# Altium schematic sheet LED_Driver_NF2W757GT-F1.SchDoc: STB Light Board - 5000K
size A3; Author: mayerph; DrawnBy: mayerph; Organization: PBL; Revision: A; SheetNumber: 7; SheetTotal: 20
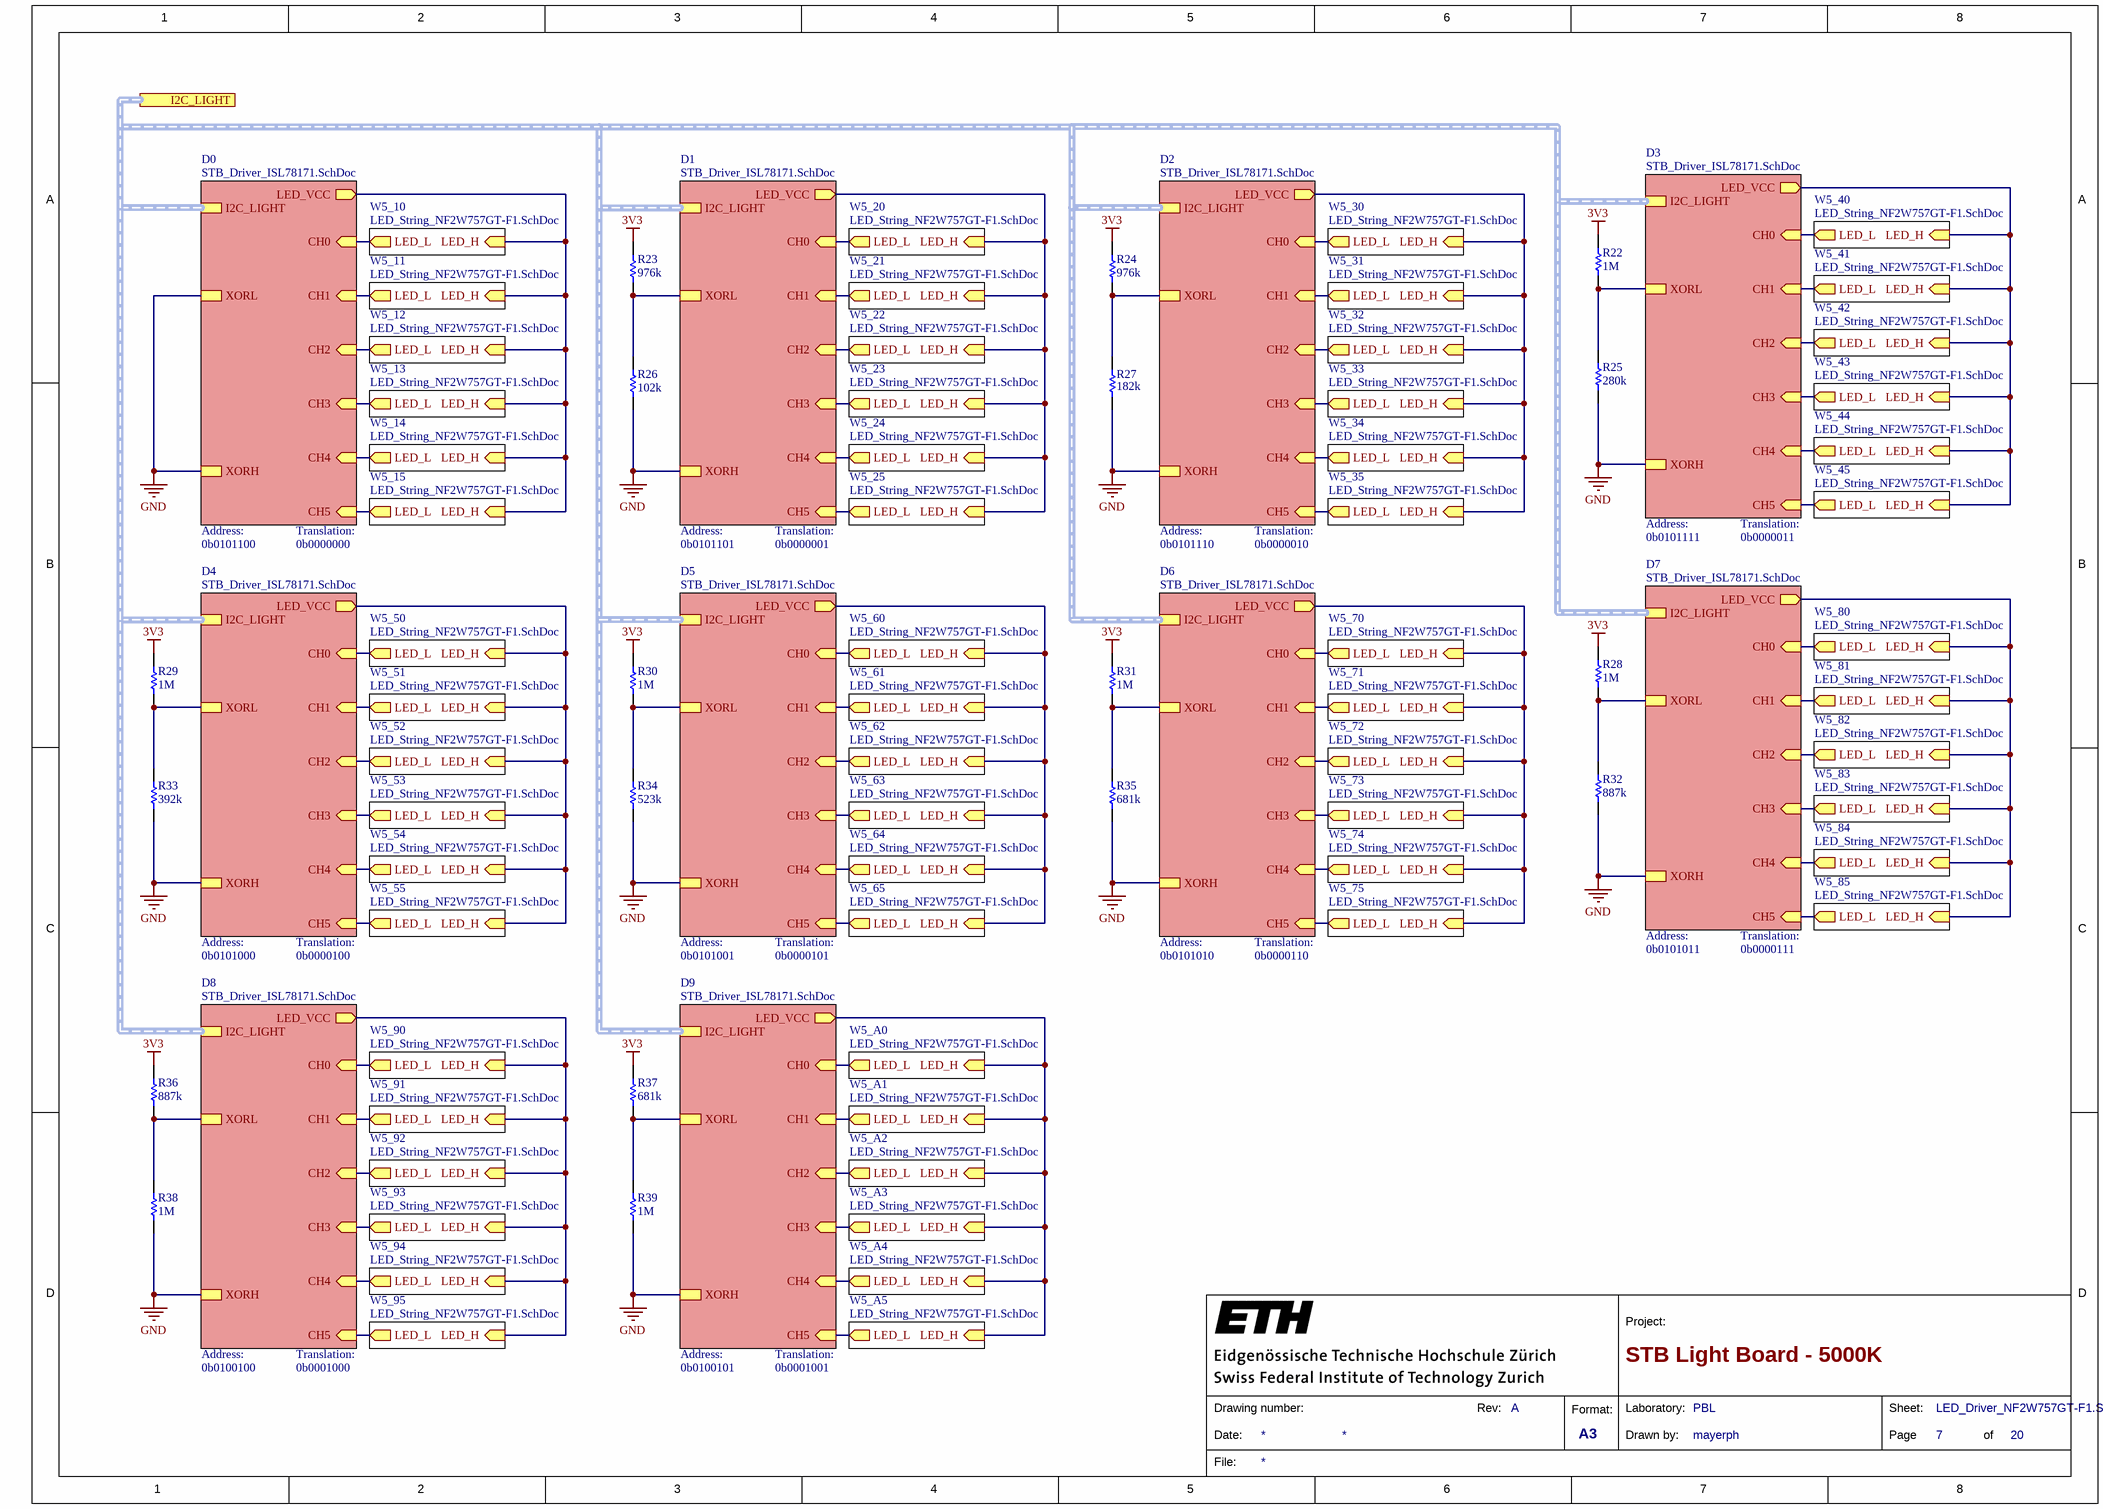
[diagram p0: LED_Driver_NF2W757GT-F1.SchDoc]

## Parts
R22  1M  [RESC1005X40X25LL05T05]
R23  976k  [RESC1005X40X25LL05T05]
R24  976k  [RESC1005X40X25LL05T05]
R25  280k  [RESC1005X40X25LL05T05]
R26  102k  [RESC1005X40X25LL05T05]
R27  182k  [RESC1005X40X25LL05T05]
R28  1M  [RESC1005X40X25LL05T05]
R29  1M  [RESC1005X40X25LL05T05]
R30  1M  [RESC1005X40X25LL05T05]
R31  1M  [RESC1005X40X25LL05T05]
R32  887k  [RESC1005X40X25LL05T10]
R33  392k  [RESC1005X40X25LL05T05]
R34  523k  [RESC1005X40X25LL05T05]
R35  681k  [RESC1005X40X25LL05T05]
R36  887k  [RESC1005X40X25LL05T10]
R37  681k  [RESC1005X40X25LL05T05]
R38  1M  [RESC1005X40X25LL05T05]
R39  1M  [RESC1005X40X25LL05T05]

## Sub-sheets
D0 = STB_Driver_ISL78171.SchDoc: CH0 (in), XORL, XORH, LED_VCC (out), CH1 (in), CH2 (in), CH3 (in), CH4 (in), CH5 (in), I2C_LIGHT (harness I2C_LIGHT)
D1 = STB_Driver_ISL78171.SchDoc: CH0 (in), XORL, XORH, LED_VCC (out), CH1 (in), CH2 (in), CH3 (in), CH4 (in), CH5 (in), I2C_LIGHT (harness I2C_LIGHT)
D2 = STB_Driver_ISL78171.SchDoc: CH0 (in), XORL, XORH, LED_VCC (out), CH1 (in), CH2 (in), CH3 (in), CH4 (in), CH5 (in), I2C_LIGHT (harness I2C_LIGHT)
D3 = STB_Driver_ISL78171.SchDoc: CH0 (in), XORL, XORH, LED_VCC (out), CH1 (in), CH2 (in), CH3 (in), CH4 (in), CH5 (in), I2C_LIGHT (harness I2C_LIGHT)
D4 = STB_Driver_ISL78171.SchDoc: CH0 (in), XORL, XORH, LED_VCC (out), CH1 (in), CH2 (in), CH3 (in), CH4 (in), CH5 (in), I2C_LIGHT (harness I2C_LIGHT)
D5 = STB_Driver_ISL78171.SchDoc: CH0 (in), XORL, XORH, LED_VCC (out), CH1 (in), CH2 (in), CH3 (in), CH4 (in), CH5 (in), I2C_LIGHT (harness I2C_LIGHT)
D6 = STB_Driver_ISL78171.SchDoc: CH0 (in), XORL, XORH, LED_VCC (out), CH1 (in), CH2 (in), CH3 (in), CH4 (in), CH5 (in), I2C_LIGHT (harness I2C_LIGHT)
D7 = STB_Driver_ISL78171.SchDoc: CH0 (in), XORL, XORH, LED_VCC (out), CH1 (in), CH2 (in), CH3 (in), CH4 (in), CH5 (in), I2C_LIGHT (harness I2C_LIGHT)
D8 = STB_Driver_ISL78171.SchDoc: CH0 (in), XORL, XORH, LED_VCC (out), CH1 (in), CH2 (in), CH3 (in), CH4 (in), CH5 (in), I2C_LIGHT (harness I2C_LIGHT)
D9 = STB_Driver_ISL78171.SchDoc: CH0 (in), XORL, XORH, LED_VCC (out), CH1 (in), CH2 (in), CH3 (in), CH4 (in), CH5 (in), I2C_LIGHT (harness I2C_LIGHT)
W5_10 = LED_String_NF2W757GT-F1.SchDoc: LED_H (in), LED_L (out)
W5_11 = LED_String_NF2W757GT-F1.SchDoc: LED_H (in), LED_L (out)
W5_12 = LED_String_NF2W757GT-F1.SchDoc: LED_H (in), LED_L (out)
W5_13 = LED_String_NF2W757GT-F1.SchDoc: LED_H (in), LED_L (out)
W5_14 = LED_String_NF2W757GT-F1.SchDoc: LED_H (in), LED_L (out)
W5_15 = LED_String_NF2W757GT-F1.SchDoc: LED_H (in), LED_L (out)
W5_20 = LED_String_NF2W757GT-F1.SchDoc: LED_H (in), LED_L (out)
W5_21 = LED_String_NF2W757GT-F1.SchDoc: LED_H (in), LED_L (out)
W5_22 = LED_String_NF2W757GT-F1.SchDoc: LED_H (in), LED_L (out)
W5_23 = LED_String_NF2W757GT-F1.SchDoc: LED_H (in), LED_L (out)
W5_24 = LED_String_NF2W757GT-F1.SchDoc: LED_H (in), LED_L (out)
W5_25 = LED_String_NF2W757GT-F1.SchDoc: LED_H (in), LED_L (out)
W5_30 = LED_String_NF2W757GT-F1.SchDoc: LED_H (in), LED_L (out)
W5_31 = LED_String_NF2W757GT-F1.SchDoc: LED_H (in), LED_L (out)
W5_32 = LED_String_NF2W757GT-F1.SchDoc: LED_H (in), LED_L (out)
W5_33 = LED_String_NF2W757GT-F1.SchDoc: LED_H (in), LED_L (out)
W5_34 = LED_String_NF2W757GT-F1.SchDoc: LED_H (in), LED_L (out)
W5_35 = LED_String_NF2W757GT-F1.SchDoc: LED_H (in), LED_L (out)
W5_40 = LED_String_NF2W757GT-F1.SchDoc: LED_H (in), LED_L (out)
W5_41 = LED_String_NF2W757GT-F1.SchDoc: LED_H (in), LED_L (out)
W5_42 = LED_String_NF2W757GT-F1.SchDoc: LED_H (in), LED_L (out)
W5_43 = LED_String_NF2W757GT-F1.SchDoc: LED_H (in), LED_L (out)
W5_44 = LED_String_NF2W757GT-F1.SchDoc: LED_H (in), LED_L (out)
W5_45 = LED_String_NF2W757GT-F1.SchDoc: LED_H (in), LED_L (out)
W5_50 = LED_String_NF2W757GT-F1.SchDoc: LED_H (in), LED_L (out)
W5_51 = LED_String_NF2W757GT-F1.SchDoc: LED_H (in), LED_L (out)
W5_52 = LED_String_NF2W757GT-F1.SchDoc: LED_H (in), LED_L (out)
W5_53 = LED_String_NF2W757GT-F1.SchDoc: LED_H (in), LED_L (out)
W5_54 = LED_String_NF2W757GT-F1.SchDoc: LED_H (in), LED_L (out)
W5_55 = LED_String_NF2W757GT-F1.SchDoc: LED_H (in), LED_L (out)
W5_60 = LED_String_NF2W757GT-F1.SchDoc: LED_H (in), LED_L (out)
W5_61 = LED_String_NF2W757GT-F1.SchDoc: LED_H (in), LED_L (out)
W5_62 = LED_String_NF2W757GT-F1.SchDoc: LED_H (in), LED_L (out)
W5_63 = LED_String_NF2W757GT-F1.SchDoc: LED_H (in), LED_L (out)
W5_64 = LED_String_NF2W757GT-F1.SchDoc: LED_H (in), LED_L (out)
W5_65 = LED_String_NF2W757GT-F1.SchDoc: LED_H (in), LED_L (out)
W5_70 = LED_String_NF2W757GT-F1.SchDoc: LED_H (in), LED_L (out)
W5_71 = LED_String_NF2W757GT-F1.SchDoc: LED_H (in), LED_L (out)
W5_72 = LED_String_NF2W757GT-F1.SchDoc: LED_H (in), LED_L (out)
W5_73 = LED_String_NF2W757GT-F1.SchDoc: LED_H (in), LED_L (out)
W5_74 = LED_String_NF2W757GT-F1.SchDoc: LED_H (in), LED_L (out)
W5_75 = LED_String_NF2W757GT-F1.SchDoc: LED_H (in), LED_L (out)
W5_80 = LED_String_NF2W757GT-F1.SchDoc: LED_H (in), LED_L (out)
W5_81 = LED_String_NF2W757GT-F1.SchDoc: LED_H (in), LED_L (out)
W5_82 = LED_String_NF2W757GT-F1.SchDoc: LED_H (in), LED_L (out)
W5_83 = LED_String_NF2W757GT-F1.SchDoc: LED_H (in), LED_L (out)
W5_84 = LED_String_NF2W757GT-F1.SchDoc: LED_H (in), LED_L (out)
W5_85 = LED_String_NF2W757GT-F1.SchDoc: LED_H (in), LED_L (out)
W5_90 = LED_String_NF2W757GT-F1.SchDoc: LED_H (in), LED_L (out)
W5_91 = LED_String_NF2W757GT-F1.SchDoc: LED_H (in), LED_L (out)
W5_92 = LED_String_NF2W757GT-F1.SchDoc: LED_H (in), LED_L (out)
W5_93 = LED_String_NF2W757GT-F1.SchDoc: LED_H (in), LED_L (out)
W5_94 = LED_String_NF2W757GT-F1.SchDoc: LED_H (in), LED_L (out)
W5_95 = LED_String_NF2W757GT-F1.SchDoc: LED_H (in), LED_L (out)
W5_A0 = LED_String_NF2W757GT-F1.SchDoc: LED_H (in), LED_L (out)
W5_A1 = LED_String_NF2W757GT-F1.SchDoc: LED_H (in), LED_L (out)
W5_A2 = LED_String_NF2W757GT-F1.SchDoc: LED_H (in), LED_L (out)
W5_A3 = LED_String_NF2W757GT-F1.SchDoc: LED_H (in), LED_L (out)
W5_A4 = LED_String_NF2W757GT-F1.SchDoc: LED_H (in), LED_L (out)
W5_A5 = LED_String_NF2W757GT-F1.SchDoc: LED_H (in), LED_L (out)

## Ports
I2C_LIGHT (harness I2C_LIGHT, see STB_LightBoard[3C], LED_Driver_AREM-80C0[1A], LED_Driver_AREM-90C0[1A], LED_Driver_NE2B757GT[2B], LED_Driver_NE2G757GT[2B], LED_Driver_NE2R757GT-P6[2B], LED_Driver_NF2L757GT-F1[1A], LED_Driver_QBHP686[1A], STB_Driver_ISL78171[1A], STB_FanControl[1A], STB_UID[1A])

## Nets
3V3: R22.2 R23.2 R24.2 R28.2 R29.2 R30.2 R31.2 R36.2 R37.2
GND: R25.1 R26.1 R27.1 R32.1 R33.1 R34.1 R35.1 R38.1 R39.1 ; sheet D0/XORL, sheet D0/XORH, sheet D1/XORH, sheet D2/XORH, sheet D3/XORH, sheet D5/XORH, sheet D6/XORH, sheet D7/XORH, sheet D4/XORH, sheet D9/XORH, sheet D8/XORH
NetR22_1: R22.1 R25.2 ; sheet D3/XORL
NetR23_1: R23.1 R26.2 ; sheet D1/XORL
NetR24_1: R24.1 R27.2 ; sheet D2/XORL
NetR28_1: R28.1 R32.2 ; sheet D7/XORL
NetR29_1: R29.1 R33.2 ; sheet D4/XORL
NetR30_1: R30.1 R34.2 ; sheet D5/XORL
NetR31_1: R31.1 R35.2 ; sheet D6/XORL
NetR36_1: R36.1 R38.2 ; sheet D8/XORL
NetR37_1: R37.1 R39.2 ; sheet D9/XORL
(unnamed): sheet D0/CH0, sheet W5_10/LED_L
(unnamed): sheet D0/LED_VCC, sheet W5_10/LED_H, sheet W5_11/LED_H, sheet W5_12/LED_H, sheet W5_13/LED_H, sheet W5_14/LED_H, sheet W5_15/LED_H
(unnamed): sheet D0/CH1, sheet W5_11/LED_L
(unnamed): sheet D0/CH2, sheet W5_12/LED_L
(unnamed): sheet D0/CH3, sheet W5_13/LED_L
(unnamed): sheet D0/CH4, sheet W5_14/LED_L
(unnamed): sheet D0/CH5, sheet W5_15/LED_L
(unnamed): sheet D1/CH0, sheet W5_20/LED_L
(unnamed): sheet D1/LED_VCC, sheet W5_20/LED_H, sheet W5_21/LED_H, sheet W5_22/LED_H, sheet W5_23/LED_H, sheet W5_24/LED_H, sheet W5_25/LED_H
(unnamed): sheet D1/CH1, sheet W5_21/LED_L
(unnamed): sheet D1/CH2, sheet W5_22/LED_L
(unnamed): sheet D1/CH3, sheet W5_23/LED_L
(unnamed): sheet D1/CH4, sheet W5_24/LED_L
(unnamed): sheet D1/CH5, sheet W5_25/LED_L
(unnamed): sheet D2/CH0, sheet W5_30/LED_L
(unnamed): sheet D2/LED_VCC, sheet W5_30/LED_H, sheet W5_31/LED_H, sheet W5_32/LED_H, sheet W5_33/LED_H, sheet W5_34/LED_H, sheet W5_35/LED_H
(unnamed): sheet D2/CH1, sheet W5_31/LED_L
(unnamed): sheet D2/CH2, sheet W5_32/LED_L
(unnamed): sheet D2/CH3, sheet W5_33/LED_L
(unnamed): sheet D2/CH4, sheet W5_34/LED_L
(unnamed): sheet D2/CH5, sheet W5_35/LED_L
(unnamed): sheet D3/CH0, sheet W5_40/LED_L
(unnamed): sheet D3/LED_VCC, sheet W5_40/LED_H, sheet W5_41/LED_H, sheet W5_42/LED_H, sheet W5_43/LED_H, sheet W5_44/LED_H, sheet W5_45/LED_H
(unnamed): sheet D3/CH1, sheet W5_41/LED_L
(unnamed): sheet D3/CH2, sheet W5_42/LED_L
(unnamed): sheet D3/CH3, sheet W5_43/LED_L
(unnamed): sheet D3/CH4, sheet W5_44/LED_L
(unnamed): sheet D3/CH5, sheet W5_45/LED_L
(unnamed): sheet D5/CH0, sheet W5_60/LED_L
(unnamed): sheet D5/LED_VCC, sheet W5_60/LED_H, sheet W5_61/LED_H, sheet W5_62/LED_H, sheet W5_63/LED_H, sheet W5_64/LED_H, sheet W5_65/LED_H
(unnamed): sheet D5/CH1, sheet W5_61/LED_L
(unnamed): sheet D5/CH2, sheet W5_62/LED_L
(unnamed): sheet D5/CH3, sheet W5_63/LED_L
(unnamed): sheet D5/CH4, sheet W5_64/LED_L
(unnamed): sheet D5/CH5, sheet W5_65/LED_L
(unnamed): sheet D6/CH0, sheet W5_70/LED_L
(unnamed): sheet D6/LED_VCC, sheet W5_70/LED_H, sheet W5_71/LED_H, sheet W5_72/LED_H, sheet W5_73/LED_H, sheet W5_74/LED_H, sheet W5_75/LED_H
(unnamed): sheet D6/CH1, sheet W5_71/LED_L
(unnamed): sheet D6/CH2, sheet W5_72/LED_L
(unnamed): sheet D6/CH3, sheet W5_73/LED_L
(unnamed): sheet D6/CH4, sheet W5_74/LED_L
(unnamed): sheet D6/CH5, sheet W5_75/LED_L
(unnamed): sheet D7/CH0, sheet W5_80/LED_L
(unnamed): sheet D7/LED_VCC, sheet W5_80/LED_H, sheet W5_81/LED_H, sheet W5_82/LED_H, sheet W5_83/LED_H, sheet W5_84/LED_H, sheet W5_85/LED_H
(unnamed): sheet D7/CH1, sheet W5_81/LED_L
(unnamed): sheet D7/CH2, sheet W5_82/LED_L
(unnamed): sheet D7/CH3, sheet W5_83/LED_L
(unnamed): sheet D7/CH4, sheet W5_84/LED_L
(unnamed): sheet D7/CH5, sheet W5_85/LED_L
(unnamed): sheet D4/CH0, sheet W5_50/LED_L
(unnamed): sheet D4/LED_VCC, sheet W5_50/LED_H, sheet W5_51/LED_H, sheet W5_52/LED_H, sheet W5_53/LED_H, sheet W5_54/LED_H, sheet W5_55/LED_H
(unnamed): sheet D4/CH1, sheet W5_51/LED_L
(unnamed): sheet D4/CH2, sheet W5_52/LED_L
(unnamed): sheet D4/CH3, sheet W5_53/LED_L
(unnamed): sheet D4/CH4, sheet W5_54/LED_L
(unnamed): sheet D4/CH5, sheet W5_55/LED_L
(unnamed): sheet D9/CH0, sheet W5_A0/LED_L
(unnamed): sheet D9/LED_VCC, sheet W5_A0/LED_H, sheet W5_A1/LED_H, sheet W5_A2/LED_H, sheet W5_A3/LED_H, sheet W5_A4/LED_H, sheet W5_A5/LED_H
(unnamed): sheet D9/CH1, sheet W5_A1/LED_L
(unnamed): sheet D9/CH2, sheet W5_A2/LED_L
(unnamed): sheet D9/CH3, sheet W5_A3/LED_L
(unnamed): sheet D9/CH4, sheet W5_A4/LED_L
(unnamed): sheet D9/CH5, sheet W5_A5/LED_L
(unnamed): sheet D8/CH0, sheet W5_90/LED_L
(unnamed): sheet D8/LED_VCC, sheet W5_90/LED_H, sheet W5_91/LED_H, sheet W5_92/LED_H, sheet W5_93/LED_H, sheet W5_94/LED_H, sheet W5_95/LED_H
(unnamed): sheet D8/CH1, sheet W5_91/LED_L
(unnamed): sheet D8/CH2, sheet W5_92/LED_L
(unnamed): sheet D8/CH3, sheet W5_93/LED_L
(unnamed): sheet D8/CH4, sheet W5_94/LED_L
(unnamed): sheet D8/CH5, sheet W5_95/LED_L

## Buses and harness runs
harness port I2C_LIGHT = sheet D0/I2C_LIGHT = sheet D1/I2C_LIGHT = sheet D2/I2C_LIGHT = sheet D3/I2C_LIGHT = sheet D4/I2C_LIGHT = sheet D5/I2C_LIGHT = sheet D6/I2C_LIGHT = sheet D7/I2C_LIGHT = sheet D8/I2C_LIGHT = sheet D9/I2C_LIGHT

## Notes on the sheet
- 0b0101100
- Address:
- 0b0000000
- Translation:
- 0b0101101
- 0b0000001
- 0b0101110
- 0b0000010
- 0b0101111
- 0b0000011
- 0b0101000
- 0b0000100
- 0b0101001
- 0b0000101
- 0b0101010
- 0b0000110
- 0b0101011
- 0b0000111
- 0b0100100
- 0b0001000
- 0b0100101
- 0b0001001
- 1
- 2
- 3
- 4
- 5
- 6
- 7
- 8
- A
- B
- C
- D
- Project:
- Date:
- Drawing number:
- Rev:
- Format:
- A3
- Drawn by:
- Laboratory:
- Page
- Sheet:
- of
- File:

## Library data of the parts
R22 R28-R31 R38 R39 = CMP-2002-00609-3: Chip Resistor, 1 MOhm, +/- 1%, 100 mW, -55 to 155 degC, 0402 (1005 Metric), RoHS, Tape and Reel; PartNumber: ERJ-2RKF1004X; Manufacturer: Basic Passives; Voltage Rating: 50 V; Case\/Package: 0402; Value: 1 MOhm; Power Rating: 100 mW; Rated Power Dissipation (P): 100mW; Temperature Coefficient: 100ppm/°C; Working Voltage: 50V; Rated Temperature: 70°C; Package Height: 0.35mm; Package Length: 1mm; Package Width: 0.5mm; Reference Standard: AEC-Q200; Pins: 2; Max Operating Temperature: 155 degC; ComponentLink2URL: http://industrial.panasonic.com/cdbs/www-data/pdf/RDA0000/AOA0000C86.pdf; Weight: 2.8E-05oz; ComponentLink1URL: http://www.panasonic.com/; Radiation Hardening: No; Height: 0.35 mm; Case Code (Imperial): 0402; ComponentLink2Description: Datasheet; Mount: Surface Mount; ComponentLink1Description: Manufacturer URL; REACH SVHC: Yes; Length: 1 mm; Min Operating Temperature: -55 degC; Width: 0.5 mm; Package Quantity: 10000; Tolerance: 1%; PackageDescription: 2-Pin Surface Mount Device, Body 1 x 0.5 mm; RoHSCompliant: true; DatasheetVersion: 04/2015; PackageReference: 0402; Mounting Technology: Surface Mount; Case Code (Metric): 1005; Packaging: Tape and Reel; Supplier 1: Digi-Key; Supplier Part Number 1: P1.00MLDKR-ND; Manufacturer Part Number: ERJ-2RKF1004X; RoHS: Yes; Category: Chip SMD Resistors; Stock 1: 1012879; Pricing 1: 1=0.10000, 10=0.03300, 100=0.01330, 1000=0.00599, 2500=0.00520, 5000=0.00429 (USD); Number of Pins: 2; Package Shape: Rectangular; Size Code: 0402; Terminal Finish: Nickel; JESD-609 Code: e3; Resistor Type: FIXED RESISTOR; Construction: Rectangular; Package Style: SMTMeter; Technology: METAL GLAZE/THICK FILM; Termination: Wraparound; Reach SVHC Compliant: Yes; RoHS Compliant: Yes; ComponentLink3URL: https://datasheet.ciiva.com:443/pdfs/VipMasterIC/IC/PANA/PANA-S-A0009889626/PANA-S-A0009889626-1.pdf?src-supplier=IHS+Markit; ComponentLink3Description: https://datasheet.ciiva.com:443/pdfs/VipMasterIC/IC/PANA/PANA-S-A0009889626/PANA-S-A0009889626-1.pdf?src-supplier=IHS+Markit; ComponentLink4URL: https://datasheet.ciiva.com/34303/1987046-34303551.pdf?src-supplier=Jameco; ComponentLink4Description: https://datasheet.ciiva.com/34303/1987046-34303551.pdf?src-supplier=Jameco; ComponentLink5URL: https://datasheet.ciiva.com/11821/0900766b80f80784-11821229.pdf?src-supplier=RSComponents; ComponentLink5Description: https://datasheet.ciiva.com/11821/0900766b80f80784-11821229.pdf?src-supplier=RSComponents; ComponentLink6URL: https://datasheet.ciiva.com/7909/aoa0000ce2-7909180.pdf?src-supplier=Element14; ComponentLink6Description: https://datasheet.ciiva.com/7909/aoa0000ce2-7909180.pdf?src-supplier=Element14; ComponentLink7URL: https://datasheet.ciiva.com/22723/1678782-22723164.pdf?src-supplier=Element14; ComponentLink7Description: https://datasheet.ciiva.com/22723/1678782-22723164.pdf?src-supplier=Element14; ComponentLink8URL: https://datasheet.ciiva.com/24158/aoa0000ce2-24158990.pdf?src-supplier=Mouser; ComponentLink8Description: https://datasheet.ciiva.com/24158/aoa0000ce2-24158990.pdf?src-supplier=Mouser; ComponentLink9URL: https://datasheet.ciiva.com/16766/70260748-16766711.pdf?src-supplier=Allied+Electronics; ComponentLink9Description: https://datasheet.ciiva.com/16766/70260748-16766711.pdf?src-supplier=Allied+Electronics; ComponentLink10URL: https://datasheet.ciiva.com/16779/70260748-16779288.pdf?src-supplier=Allied+Electronics; ComponentLink10Description: https://datasheet.ciiva.com/16779/70260748-16779288.pdf?src-supplier=Allied+Electronics; ComponentLink11URL: https://datasheet.ciiva.com/16199/aoa0000ce2-16199544.pdf?src-supplier=Future+Electronics; ComponentLink11Description: https://datasheet.ciiva.com/16199/aoa0000ce2-16199544.pdf?src-supplier=Future+Electronics
R23 R24 = CMP-2002-01120-1: Manufacturer: Panasonic; Part Number: ERJ-2RKF9763X; Tolerance: 1%; Rated Power Dissipation (P): 100mW; Rated Temperature: 70°C; Value: 976 kOhm; Temperature Coefficient: 100ppm/°C; Working Voltage: 50V; Package Height: 0.35mm; Package Length: 1mm; Package Width: 0.5mm; Reference Standard: AEC-Q200; Supplier 1: Digi-Key; Supplier Part Number 1: P976KLCT-ND; Manufacturer Part Number: ERJ-2RKF9763X; RoHS: Yes; Category: Chip SMD Resistors; Stock 1: 136638; Pricing 1: 1=0.10000, 10=0.03300, 100=0.01330, 1000=0.00599, 2500=0.00520, 5000=0.00429 (USD); Mount: Surface Mount; Number of Pins: 2; Size Code: 0402; Terminal Finish: Nickel; Package Shape: Rectangular; Min Operating Temperature: -55°C; Max Operating Temperature: 155°C; Resistor Type: FIXED RESISTOR; Construction: Rectangular; Package Style: SMTMeter; Packaging: Tape and Reel; Termination: Wraparound; JESD-609 Code: e3; Technology: METAL GLAZE/THICK FILM; Reach SVHC Compliant: Yes; RoHS Compliant: Yes; ComponentLink1URL: https://datasheet.ciiva.com:443/pdfs/VipMasterIC/IC/PANA/PANA-S-A0009889626/PANA-S-A0009889626-1.pdf?src-supplier=IHS+Markit; ComponentLink1Description: https://datasheet.ciiva.com:443/pdfs/VipMasterIC/IC/PANA/PANA-S-A0009889626/PANA-S-A0009889626-1.pdf?src-supplier=IHS+Markit; ComponentLink2URL: https://datasheet.ciiva.com/43467/1678782-43467581.pdf?src-supplier=Farnell; ComponentLink2Description: https://datasheet.ciiva.com/43467/1678782-43467581.pdf?src-supplier=Farnell; ComponentLink3URL: https://datasheet.ciiva.com/46372/1678782-46372911.pdf?src-supplier=Element14; ComponentLink3Description: https://datasheet.ciiva.com/46372/1678782-46372911.pdf?src-supplier=Element14; ComponentLink4URL: https://datasheet.ciiva.com/22668/1678782-22668415.pdf?src-supplier=Element14; ComponentLink4Description: https://datasheet.ciiva.com/22668/1678782-22668415.pdf?src-supplier=Element14; ComponentLink5URL: https://datasheet.ciiva.com/16758/70260748-16758903.pdf?src-supplier=Allied+Electronics; ComponentLink5Description: https://datasheet.ciiva.com/16758/70260748-16758903.pdf?src-supplier=Allied+Electronics; ComponentLink6URL: https://datasheet.ciiva.com/9179/aoa0000ce2-9179357.pdf?src-supplier=Avnet; ComponentLink6Description: https://datasheet.ciiva.com/9179/aoa0000ce2-9179357.pdf?src-supplier=Avnet; ComponentLink7URL: https://datasheet.ciiva.com/30176/aoa0000ce2-30176831.pdf?src-supplier=Onlinecomponents.com; ComponentLink7Description: https://datasheet.ciiva.com/30176/aoa0000ce2-30176831.pdf?src-supplier=Onlinecomponents.com
R25 = CMP-1011-00785-4: Chip Resistor, 280 KOhm, +/- 1%, 100 mW, -55 to 155 degC, 0402 (1005 Metric), RoHS, Cut Tape; PartNumber: ERJ-2RKF2803X; Manufacturer: Basic Passives; Power Rating: 100 mW; Case\/Package: 0402; Voltage Rating: 50 V; Rated Power Dissipation (P): 100mW; Rated Temperature: 70°C; Temperature Coefficient: 100ppm/°C; Working Voltage: 50V; Package Height: 0.35mm; Package Length: 1mm; Package Width: 0.5mm; Reference Standard: AEC-Q200; Value: 280 kOhm; Width: 0.02 inch; Packaging: Cut Tape; Min Operating Temperature: -55 degC; Package Quantity: 10000; Height: 0.016 inch; ComponentLink2Description: Datasheet; REACH SVHC: Yes; Length: 0.039 inch; Mounting Technology: Surface Mount; Mount: Surface Mount; ComponentLink1Description: Manufacturer URL; PackageDescription: 2-Pin Surface Mount Device, Body 1 x 0.5 mm; PackageReference: 0402; Case Code (Metric): 1005; ComponentLink2URL: http://industrial.panasonic.com/cdbs/www-data/pdf/RDA0000/AOA0000C86.pdf; Pins: 2; DatasheetVersion: 04/2015; ComponentLink1URL: http://www.panasonic.com/; RoHSCompliant: true; Case Code (Imperial): 0402; Tolerance: 1%; Max Operating Temperature: 155 degC; Supplier 1: Digi-Key; Supplier Part Number 1: P280KLDKR-ND; Manufacturer Part Number: ERJ-2RKF2803X; RoHS: Yes; Category: Chip SMD Resistors; Stock 1: 156859; Pricing 1: 1=0.10000, 10=0.03300, 100=0.01330, 1000=0.00599, 2500=0.00520, 5000=0.00429 (USD); Number of Pins: 2; Size Code: 0402; Terminal Finish: Nickel; Package Shape: Rectangular; Resistor Type: FIXED RESISTOR; Termination: Wraparound; JESD-609 Code: e3; Construction: Rectangular; Package Style: SMTMeter; Technology: METAL GLAZE/THICK FILM; Reach SVHC Compliant: Yes; RoHS Compliant: Yes; ComponentLink3URL: https://datasheet.ciiva.com:443/pdfs/VipMasterIC/IC/PANA/PANA-S-A0009889626/PANA-S-A0009889626-1.pdf?src-supplier=IHS+Markit; ComponentLink3Description: https://datasheet.ciiva.com:443/pdfs/VipMasterIC/IC/PANA/PANA-S-A0009889626/PANA-S-A0009889626-1.pdf?src-supplier=IHS+Markit; ComponentLink4URL: https://datasheet.ciiva.com/9183/aoa0000ce2-9183500.pdf?src-supplier=Avnet; ComponentLink4Description: https://datasheet.ciiva.com/9183/aoa0000ce2-9183500.pdf?src-supplier=Avnet; ComponentLink5URL: https://datasheet.ciiva.com/28594/1694929-28594570.pdf?src-supplier=Element14; ComponentLink5Description: https://datasheet.ciiva.com/28594/1694929-28594570.pdf?src-supplier=Element14; ComponentLink6URL: https://datasheet.ciiva.com/24024/aoa0000ce2-24024731.pdf?src-supplier=Mouser; ComponentLink6Description: https://datasheet.ciiva.com/24024/aoa0000ce2-24024731.pdf?src-supplier=Mouser; ComponentLink7URL: https://datasheet.ciiva.com/30177/aoa0000ce2-30177532.pdf?src-supplier=Onlinecomponents.com; ComponentLink7Description: https://datasheet.ciiva.com/30177/aoa0000ce2-30177532.pdf?src-supplier=Onlinecomponents.com; ComponentLink8URL: https://datasheet.ciiva.com/7712/1678782-7712815.pdf?src-supplier=Element14; ComponentLink8Description: https://datasheet.ciiva.com/7712/1678782-7712815.pdf?src-supplier=Element14
R26 = CMP-2002-00613-1: Manufacturer: Panasonic; Part Number: ERJ-2RKF1023X; Tolerance: 1%; Rated Power Dissipation (P): 100mW; Rated Temperature: 70°C; Value: 102 kOhm; Temperature Coefficient: 100ppm/°C; Working Voltage: 50V; Package Height: 0.35mm; Package Length: 1mm; Package Width: 0.5mm; Reference Standard: AEC-Q200; Supplier 1: Digi-Key; Supplier Part Number 1: P102KLDKR-ND; Manufacturer Part Number: ERJ-2RKF1023X; RoHS: Yes; Category: Chip SMD Resistors; Stock 1: 79400; Pricing 1: 1=0.10000, 10=0.03300, 100=0.01330, 1000=0.00599, 2500=0.00520, 5000=0.00429 (USD); Mount: Surface Mount; Number of Pins: 2; Size Code: 0402; Terminal Finish: Nickel; Package Shape: Rectangular; Min Operating Temperature: -55°C; Max Operating Temperature: 155°C; Resistor Type: FIXED RESISTOR; Construction: Rectangular; Package Style: SMTMeter; Packaging: Tape and Reel; Technology: METAL GLAZE/THICK FILM; Termination: Wraparound; JESD-609 Code: e3; Reach SVHC Compliant: Yes; RoHS Compliant: Yes; ComponentLink1URL: https://datasheet.ciiva.com:443/pdfs/VipMasterIC/IC/PANA/PANA-S-A0009889626/PANA-S-A0009889626-1.pdf?src-supplier=IHS+Markit; ComponentLink1Description: https://datasheet.ciiva.com:443/pdfs/VipMasterIC/IC/PANA/PANA-S-A0009889626/PANA-S-A0009889626-1.pdf?src-supplier=IHS+Markit; ComponentLink2URL: https://datasheet.ciiva.com/43467/1678782-43467481.pdf?src-supplier=Farnell; ComponentLink2Description: https://datasheet.ciiva.com/43467/1678782-43467481.pdf?src-supplier=Farnell; ComponentLink3URL: https://datasheet.ciiva.com/9119/aoa0000ce2-9119242.pdf?src-supplier=Avnet; ComponentLink3Description: https://datasheet.ciiva.com/9119/aoa0000ce2-9119242.pdf?src-supplier=Avnet; ComponentLink4URL: https://datasheet.ciiva.com/16781/70260748-16781503.pdf?src-supplier=Allied+Electronics; ComponentLink4Description: https://datasheet.ciiva.com/16781/70260748-16781503.pdf?src-supplier=Allied+Electronics; ComponentLink5URL: https://datasheet.ciiva.com/22673/1678782-22673487.pdf?src-supplier=Element14; ComponentLink5Description: https://datasheet.ciiva.com/22673/1678782-22673487.pdf?src-supplier=Element14; ComponentLink6URL: https://datasheet.ciiva.com/16763/70260748-16763080.pdf?src-supplier=Allied+Electronics; ComponentLink6Description: https://datasheet.ciiva.com/16763/70260748-16763080.pdf?src-supplier=Allied+Electronics; ComponentLink7URL: https://datasheet.ciiva.com/7712/1678782-7712798.pdf?src-supplier=Element14; ComponentLink7Description: https://datasheet.ciiva.com/7712/1678782-7712798.pdf?src-supplier=Element14; ComponentLink8URL: https://datasheet.ciiva.com/46373/1678782-46373215.pdf?src-supplier=Element14; ComponentLink8Description: https://datasheet.ciiva.com/46373/1678782-46373215.pdf?src-supplier=Element14
R27 = CMP-2002-08256-1: Manufacturer: Vishay Dale; Part Number: CRCW0402182KFKED; Value: 182 kOhm; Tolerance: 1%; Rated Power Dissipation (P): 63mW; Resistance: 182kR; Temperature Coefficient: 100ppm/°C; Working Voltage: 50V; Rated Temperature: 70°C; Package Height: 0.35mm; Package Length: 1mm; Package Width: 0.5mm; Reference Standard: AEC-Q200; Supplier 1: Digi-Key; Supplier Part Number 1: 541-182KLDKR-ND; Manufacturer Part Number: CRCW0402182KFKED; RoHS: Yes; Category: Chip SMD Resistors; Stock 1: 76709; Pricing 1: 1=0.10000, 10=0.03600, 100=0.01460, 1000=0.00656, 2500=0.00569, 5000=0.00470 (USD); Mount: Surface Mount; Number of Pins: 2; Size Code: 0402; Terminal Finish: Nickel; Package Shape: Rectangular; Min Operating Temperature: -55°C; Max Operating Temperature: 155°C; JESD-609 Code: e3; Resistor Type: FIXED RESISTOR; Construction: Chip; Package Style: SMTMeter; Packaging: Tape and Reel; Technology: METAL GLAZE/THICK FILM; Termination: Wraparound; Reach SVHC Compliant: Yes; RoHS Compliant: Yes; ComponentLink1URL: https://datasheet.ciiva.com:443/pdfs/VipMasterIC/IC/VISH/VISH-S-A0007266705/VISH-S-A0007266705-1.pdf?src-supplier=IHS+Markit; ComponentLink1Description: https://datasheet.ciiva.com:443/pdfs/VipMasterIC/IC/VISH/VISH-S-A0007266705/VISH-S-A0007266705-1.pdf?src-supplier=IHS+Markit; ComponentLink2URL: https://datasheet.ciiva.com/3256/dcrcwe3-3256117.pdf?src-supplier=Avnet; ComponentLink2Description: https://datasheet.ciiva.com/3256/dcrcwe3-3256117.pdf?src-supplier=Avnet; ComponentLink3URL: https://datasheet.ciiva.com/2463/dcrcwe3-2463286.pdf?src-supplier=Digi-Key; ComponentLink3Description: https://datasheet.ciiva.com/2463/dcrcwe3-2463286.pdf?src-supplier=Digi-Key; ComponentLink4URL: https://datasheet.ciiva.com/5545/dcrcwe3-109170-5545910.pdf?src-supplier=Mouser; ComponentLink4Description: https://datasheet.ciiva.com/5545/dcrcwe3-109170-5545910.pdf?src-supplier=Mouser; ComponentLink5URL: https://datasheet.ciiva.com/2463/dcrcwe3-2463287.pdf?src-supplier=Digi-Key; ComponentLink5Description: https://datasheet.ciiva.com/2463/dcrcwe3-2463287.pdf?src-supplier=Digi-Key; ComponentLink6URL: https://datasheet.ciiva.com/7714/1697337-7714183.pdf?src-supplier=Element14; ComponentLink6Description: https://datasheet.ciiva.com/7714/1697337-7714183.pdf?src-supplier=Element14; ComponentLink7URL: https://datasheet.ciiva.com/2463/dcrcwe3-2463288.pdf?src-supplier=Digi-Key; ComponentLink7Description: https://datasheet.ciiva.com/2463/dcrcwe3-2463288.pdf?src-supplier=Digi-Key; ComponentLink8URL: https://datasheet.ciiva.com/16785/70201119-16785993.pdf?src-supplier=Allied+Electronics; ComponentLink8Description: https://datasheet.ciiva.com/16785/70201119-16785993.pdf?src-supplier=Allied+Electronics; ComponentLink9URL: https://datasheet.ciiva.com/7714/1697337-7714365.pdf?src-supplier=Element14; ComponentLink9Description: https://datasheet.ciiva.com/7714/1697337-7714365.pdf?src-supplier=Element14
R32 R36 = CMP-2002-07827-1: Part Number: RC0402FR-07887KL; Manufacturer: Yageo / Phycomp; Tolerance: 1%; Rated Power Dissipation (P): 62.5mW; Rated Temperature: 70°C; Value: 887 kOhm; Temperature Coefficient: 100ppm/°C; Working Voltage: 50V; Additional Feature: LASER TRIMMABLE; Package Height: 0.35mm; Package Length: 1mm; Package Width: 0.5mm; Supplier 1: Digi-Key; Supplier Part Number 1: YAG3251CT-ND; Manufacturer Part Number: RC0402FR-07887KL; RoHS: Yes; Category: Chip SMD Resistors; Stock 1: 288491; Pricing 1: 1=0.10000, 10=0.01500, 100=0.00600, 1000=0.00267, 2500=0.00232, 5000=0.00192 (USD); Mount: Surface Mount; Number of Pins: 2; Size Code: 0402; Terminal Finish: Nickel; Package Shape: Rectangular; Min Operating Temperature: -55°C; Max Operating Temperature: 155°C; Resistor Type: FIXED RESISTOR; Construction: Chip; Package Style: SMTMeter; Packaging: Tape and Reel; Termination: Wraparound; JESD-609 Code: e3; Technology: METAL GLAZE/THICK FILM; Reach SVHC Compliant: Yes; RoHS Compliant: Yes; ComponentLink1URL: https://datasheet.ciiva.com:443/pdfs/VipMasterIC/IC/YAGO/YAGO-S-A0008145938/YAGO-S-A0008145938-1.pdf?src-supplier=IHS+Markit; ComponentLink1Description: https://datasheet.ciiva.com:443/pdfs/VipMasterIC/IC/YAGO/YAGO-S-A0008145938/YAGO-S-A0008145938-1.pdf?src-supplier=IHS+Markit; ComponentLink2URL: https://datasheet.ciiva.com/16744/pyu-rc0402-51-rohs-l-6-r-16744239.pdf?src-supplier=Future+Electronics; ComponentLink2Description: https://datasheet.ciiva.com/16744/pyu-rc0402-51-rohs-l-6-r-16744239.pdf?src-supplier=Future+Electronics
R33 = CMP-2002-00914-1: Part Number: ERJ-2RKF3923X; Manufacturer: Panasonic; Tolerance: 1%; Rated Power Dissipation (P): 100mW; Rated Temperature: 70°C; Value: 392 kOhm; Temperature Coefficient: 100ppm/°C; Working Voltage: 50V; Package Height: 0.35mm; Package Length: 1mm; Package Width: 0.5mm; Reference Standard: AEC-Q200; Supplier 1: Digi-Key; Supplier Part Number 1: P392KLDKR-ND; Manufacturer Part Number: ERJ-2RKF3923X; RoHS: Yes; Category: Chip SMD Resistors; Stock 1: 100496; Pricing 1: 1=0.10000, 10=0.03300, 100=0.01330, 1000=0.00599, 2500=0.00520, 5000=0.00429 (USD); Mount: Surface Mount; Number of Pins: 2; Size Code: 0402; Terminal Finish: Nickel; Package Shape: Rectangular; Min Operating Temperature: -55°C; Max Operating Temperature: 155°C; JESD-609 Code: e3; Resistor Type: FIXED RESISTOR; Construction: Rectangular; Package Style: SMTMeter; Packaging: Tape and Reel; Technology: METAL GLAZE/THICK FILM; Termination: Wraparound; Reach SVHC Compliant: Yes; RoHS Compliant: Yes; ComponentLink1URL: https://datasheet.ciiva.com:443/pdfs/VipMasterIC/IC/PANA/PANA-S-A0009889626/PANA-S-A0009889626-1.pdf?src-supplier=IHS+Markit; ComponentLink1Description: https://datasheet.ciiva.com:443/pdfs/VipMasterIC/IC/PANA/PANA-S-A0009889626/PANA-S-A0009889626-1.pdf?src-supplier=IHS+Markit; ComponentLink2URL: https://datasheet.ciiva.com/24069/aoa0000ce2-24069223.pdf?src-supplier=Mouser; ComponentLink2Description: https://datasheet.ciiva.com/24069/aoa0000ce2-24069223.pdf?src-supplier=Mouser; ComponentLink3URL: https://datasheet.ciiva.com/30085/aoa0000ce2-30085781.pdf?src-supplier=Onlinecomponents.com; ComponentLink3Description: https://datasheet.ciiva.com/30085/aoa0000ce2-30085781.pdf?src-supplier=Onlinecomponents.com; ComponentLink4URL: https://datasheet.ciiva.com/16781/70260748-16781463.pdf?src-supplier=Allied+Electronics; ComponentLink4Description: https://datasheet.ciiva.com/16781/70260748-16781463.pdf?src-supplier=Allied+Electronics; ComponentLink5URL: https://datasheet.ciiva.com/22673/1678782-22673356.pdf?src-supplier=Element14; ComponentLink5Description: https://datasheet.ciiva.com/22673/1678782-22673356.pdf?src-supplier=Element14; ComponentLink6URL: https://datasheet.ciiva.com/46399/1678782-46399980.pdf?src-supplier=Element14; ComponentLink6Description: https://datasheet.ciiva.com/46399/1678782-46399980.pdf?src-supplier=Element14; ComponentLink7URL: https://datasheet.ciiva.com/46399/1678782-46399981.pdf?src-supplier=Element14; ComponentLink7Description: https://datasheet.ciiva.com/46399/1678782-46399981.pdf?src-supplier=Element14; ComponentLink8URL: https://datasheet.ciiva.com/22776/1678782-22776542.pdf?src-supplier=Farnell; ComponentLink8Description: https://datasheet.ciiva.com/22776/1678782-22776542.pdf?src-supplier=Farnell; ComponentLink9URL: https://datasheet.ciiva.com/16774/70260748-16774815.pdf?src-supplier=Allied+Electronics; ComponentLink9Description: https://datasheet.ciiva.com/16774/70260748-16774815.pdf?src-supplier=Allied+Electronics
R34 = CMP-2002-00982-1: Manufacturer: Panasonic; Part Number: ERJ-2RKF5233X; Tolerance: 1%; Rated Power Dissipation (P): 100mW; Value: 523 kOhm; Temperature Coefficient: 100ppm/°C; Working Voltage: 50V; Rated Temperature: 70°C; Package Height: 0.35mm; Package Length: 1mm; Package Width: 0.5mm; Reference Standard: AEC-Q200; Supplier 1: Digi-Key; Supplier Part Number 1: P523KLCT-ND; Manufacturer Part Number: ERJ-2RKF5233X; RoHS: Yes; Category: Chip SMD Resistors; Stock 1: 154886; Pricing 1: 1=0.10000, 10=0.03300, 100=0.01330, 1000=0.00599, 2500=0.00520, 5000=0.00429 (USD); Mount: Surface Mount; Number of Pins: 2; Size Code: 0402; Terminal Finish: Nickel; Package Shape: Rectangular; Min Operating Temperature: -55°C; Max Operating Temperature: 155°C; JESD-609 Code: e3; Resistor Type: FIXED RESISTOR; Construction: Rectangular; Package Style: SMTMeter; Packaging: Tape and Reel; Technology: METAL GLAZE/THICK FILM; Termination: Wraparound; Reach SVHC Compliant: Yes; RoHS Compliant: Yes; ComponentLink1URL: https://datasheet.ciiva.com:443/pdfs/VipMasterIC/IC/PANA/PANA-S-A0009889626/PANA-S-A0009889626-1.pdf?src-supplier=IHS+Markit; ComponentLink1Description: https://datasheet.ciiva.com:443/pdfs/VipMasterIC/IC/PANA/PANA-S-A0009889626/PANA-S-A0009889626-1.pdf?src-supplier=IHS+Markit; ComponentLink2URL: https://datasheet.ciiva.com/30220/aoa0000ce2-30220984.pdf?src-supplier=Onlinecomponents.com; ComponentLink2Description: https://datasheet.ciiva.com/30220/aoa0000ce2-30220984.pdf?src-supplier=Onlinecomponents.com; ComponentLink3URL: https://datasheet.ciiva.com/24027/aoa0000ce2-24027141.pdf?src-supplier=Mouser; ComponentLink3Description: https://datasheet.ciiva.com/24027/aoa0000ce2-24027141.pdf?src-supplier=Mouser; ComponentLink4URL: https://datasheet.ciiva.com/9181/aoa0000ce2-9181337.pdf?src-supplier=Avnet; ComponentLink4Description: https://datasheet.ciiva.com/9181/aoa0000ce2-9181337.pdf?src-supplier=Avnet; ComponentLink5URL: https://datasheet.ciiva.com/9181/aoa0000ce2-9181340.pdf?src-supplier=Avnet; ComponentLink5Description: https://datasheet.ciiva.com/9181/aoa0000ce2-9181340.pdf?src-supplier=Avnet; ComponentLink6URL: https://datasheet.ciiva.com/22668/1678782-22668381.pdf?src-supplier=Element14; ComponentLink6Description: https://datasheet.ciiva.com/22668/1678782-22668381.pdf?src-supplier=Element14; ComponentLink7URL: https://datasheet.ciiva.com/43467/1678782-43467550.pdf?src-supplier=Farnell; ComponentLink7Description: https://datasheet.ciiva.com/43467/1678782-43467550.pdf?src-supplier=Farnell; ComponentLink8URL: https://datasheet.ciiva.com/46372/1678782-46372943.pdf?src-supplier=Element14; ComponentLink8Description: https://datasheet.ciiva.com/46372/1678782-46372943.pdf?src-supplier=Element14
R35 R37 = CMP-2002-01040-1: Manufacturer: Panasonic; Part Number: ERJ-2RKF6813X; Tolerance: 1%; Rated Power Dissipation (P): 100mW; Rated Temperature: 70°C; Value: 681 kOhm; Temperature Coefficient: 100ppm/°C; Working Voltage: 50V; Package Height: 0.35mm; Package Length: 1mm; Package Width: 0.5mm; Reference Standard: AEC-Q200; Supplier 1: Digi-Key; Supplier Part Number 1: P681KLCT-ND; Manufacturer Part Number: ERJ-2RKF6813X; RoHS: Yes; Category: Chip SMD Resistors; Stock 1: 3837; Pricing 1: 1=0.10000, 10=0.03300, 100=0.01330, 1000=0.00599, 2500=0.00520, 5000=0.00429 (USD); Mount: Surface Mount; Number of Pins: 2; Size Code: 0402; Terminal Finish: Nickel; Package Shape: Rectangular; Min Operating Temperature: -55°C; Max Operating Temperature: 155°C; Resistor Type: FIXED RESISTOR; Packaging: Tape and Reel; Termination: Wraparound; Construction: Rectangular; Package Style: SMTMeter; Technology: METAL GLAZE/THICK FILM; JESD-609 Code: e3; Reach SVHC Compliant: Yes; RoHS Compliant: Yes; ComponentLink1URL: https://datasheet.ciiva.com:443/pdfs/VipMasterIC/IC/PANA/PANA-S-A0009889626/PANA-S-A0009889626-1.pdf?src-supplier=IHS+Markit; ComponentLink1Description: https://datasheet.ciiva.com:443/pdfs/VipMasterIC/IC/PANA/PANA-S-A0009889626/PANA-S-A0009889626-1.pdf?src-supplier=IHS+Markit; ComponentLink2URL: https://datasheet.ciiva.com/3883/3984280s8821682n1386-3883650.pdf?src-supplier=Arrow+Electronics; ComponentLink2Description: https://datasheet.ciiva.com/3883/3984280s8821682n1386-3883650.pdf?src-supplier=Arrow+Electronics; ComponentLink3URL: https://datasheet.ciiva.com/16776/70260748-16776822.pdf?src-supplier=Allied+Electronics; ComponentLink3Description: https://datasheet.ciiva.com/16776/70260748-16776822.pdf?src-supplier=Allied+Electronics; ComponentLink4URL: https://datasheet.ciiva.com/9180/aoa0000ce2-9180392.pdf?src-supplier=Avnet; ComponentLink4Description: https://datasheet.ciiva.com/9180/aoa0000ce2-9180392.pdf?src-supplier=Avnet; ComponentLink5URL: https://datasheet.ciiva.com/22673/1678782-22673368.pdf?src-supplier=Element14; ComponentLink5Description: https://datasheet.ciiva.com/22673/1678782-22673368.pdf?src-supplier=Element14; ComponentLink6URL: https://datasheet.ciiva.com/7753/1678782-7753993.pdf?src-supplier=Element14; ComponentLink6Description: https://datasheet.ciiva.com/7753/1678782-7753993.pdf?src-supplier=Element14; ComponentLink7URL: https://datasheet.ciiva.com/16771/70260748-16771449.pdf?src-supplier=Allied+Electronics; ComponentLink7Description: https://datasheet.ciiva.com/16771/70260748-16771449.pdf?src-supplier=Allied+Electronics; ComponentLink8URL: https://datasheet.ciiva.com/9180/aoa0000ce2-9180348.pdf?src-supplier=Avnet; ComponentLink8Description: https://datasheet.ciiva.com/9180/aoa0000ce2-9180348.pdf?src-supplier=Avnet; ComponentLink9URL: https://datasheet.ciiva.com/43467/1678782-43467564.pdf?src-supplier=Farnell; ComponentLink9Description: https://datasheet.ciiva.com/43467/1678782-43467564.pdf?src-supplier=Farnell; ComponentLink10URL: https://datasheet.ciiva.com/24069/aoa0000ce2-24069822.pdf?src-supplier=Mouser; ComponentLink10Description: https://datasheet.ciiva.com/24069/aoa0000ce2-24069822.pdf?src-supplier=Mouser; ComponentLink11URL: https://datasheet.ciiva.com/46373/1678782-46373118.pdf?src-supplier=Element14; ComponentLink11Description: https://datasheet.ciiva.com/46373/1678782-46373118.pdf?src-supplier=Element14; ComponentLink12URL: https://datasheet.ciiva.com/30230/aoa0000ce2-30230479.pdf?src-supplier=Onlinecomponents.com; ComponentLink12Description: https://datasheet.ciiva.com/30230/aoa0000ce2-30230479.pdf?src-supplier=Onlinecomponents.com; ComponentLink13URL: https://datasheet.ciiva.com/46373/1678782-46373119.pdf?src-supplier=Element14; ComponentLink13Description: https://datasheet.ciiva.com/46373/1678782-46373119.pdf?src-supplier=Element14